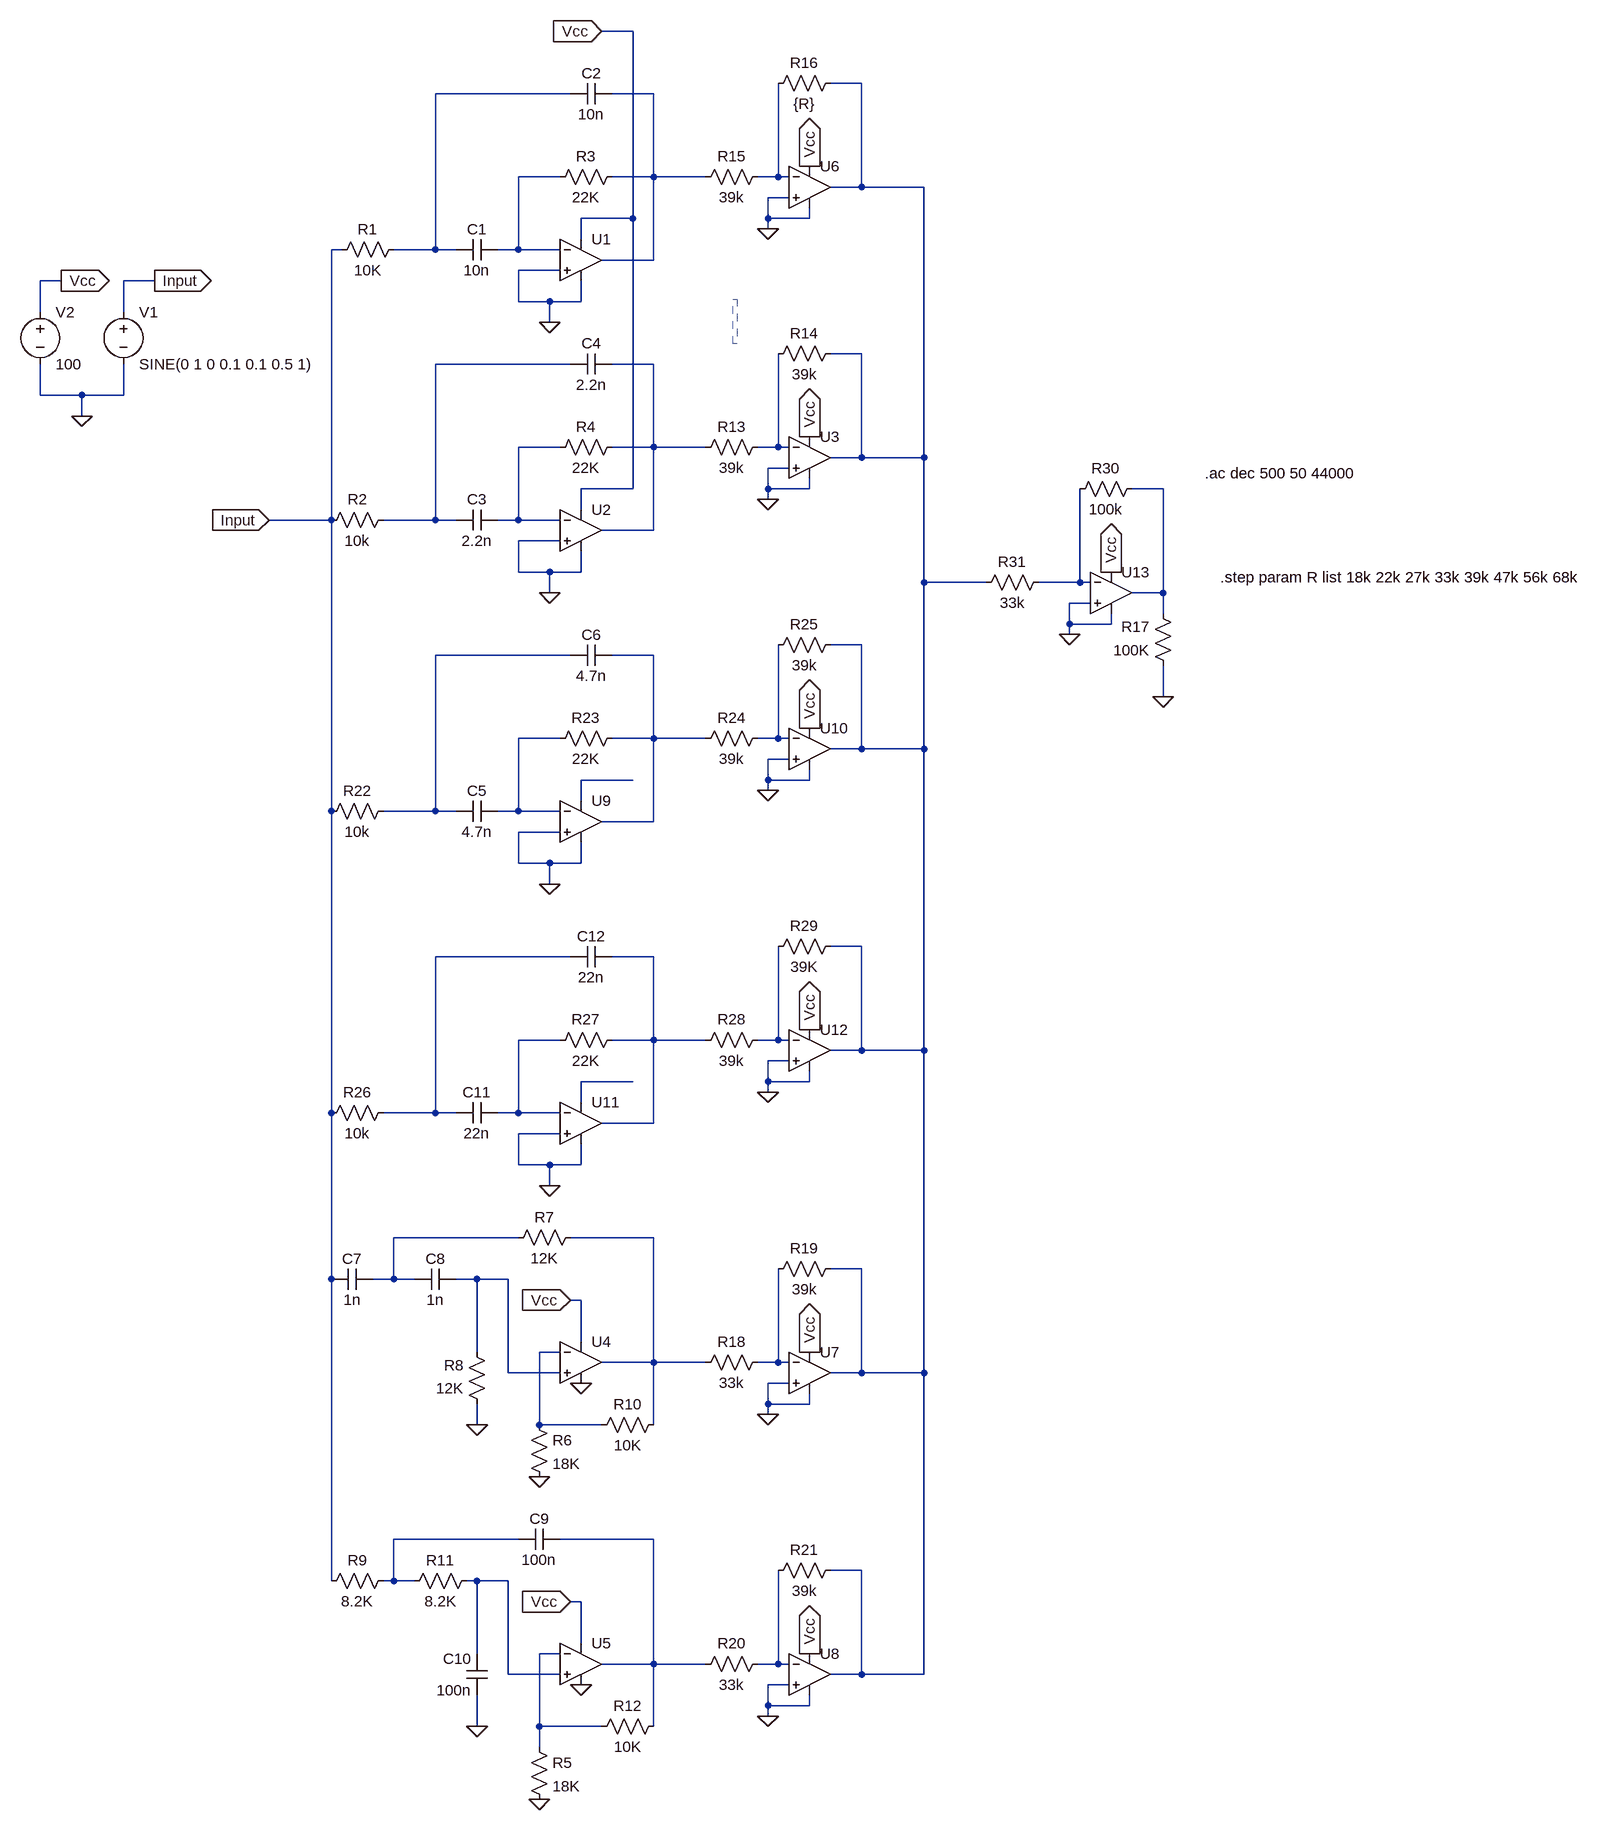
[diagram p0: schematic equalizer-analog.asc]
equalizer-analog.asc, the LTspice schematic file:
Version 4
SHEET 1 2408 2608
WIRE 928 -176 880 -176
WIRE 1280 -96 1232 -96
WIRE 832 -80 624 -80
WIRE 960 -80 896 -80
WIRE 816 48 752 48
WIRE 960 48 960 -80
WIRE 960 48 896 48
WIRE 1040 48 960 48
WIRE 1152 48 1152 -96
WIRE 1152 48 1120 48
WIRE 1168 48 1152 48
WIRE 1280 64 1280 -96
WIRE 1280 64 1232 64
WIRE 1376 64 1280 64
WIRE 1168 80 1136 80
WIRE 928 112 928 -176
WIRE 928 112 848 112
WIRE 1136 112 1136 80
WIRE 1200 112 1200 96
WIRE 1200 112 1136 112
WIRE 1136 128 1136 112
WIRE 848 144 848 112
WIRE 480 160 464 160
WIRE 624 160 624 -80
WIRE 624 160 560 160
WIRE 656 160 624 160
WIRE 752 160 752 48
WIRE 752 160 720 160
WIRE 816 160 752 160
WIRE 960 176 960 48
WIRE 960 176 880 176
WIRE 816 192 752 192
WIRE 48 208 16 208
WIRE 192 208 144 208
WIRE 752 240 752 192
WIRE 800 240 752 240
WIRE 848 240 848 208
WIRE 848 240 800 240
WIRE 16 256 16 208
WIRE 144 256 144 208
WIRE 800 272 800 240
WIRE 1280 320 1232 320
WIRE 832 336 624 336
WIRE 960 336 896 336
WIRE 16 384 16 336
WIRE 80 384 16 384
WIRE 144 384 144 336
WIRE 144 384 80 384
WIRE 80 416 80 384
WIRE 816 464 752 464
WIRE 960 464 960 336
WIRE 960 464 896 464
WIRE 1040 464 960 464
WIRE 1152 464 1152 320
WIRE 1152 464 1120 464
WIRE 1168 464 1152 464
WIRE 1280 480 1280 320
WIRE 1280 480 1232 480
WIRE 1376 480 1376 64
WIRE 1376 480 1280 480
WIRE 1168 496 1136 496
WIRE 928 528 928 112
WIRE 928 528 848 528
WIRE 1136 528 1136 496
WIRE 1200 528 1200 512
WIRE 1200 528 1136 528
WIRE 1744 528 1696 528
WIRE 1136 544 1136 528
WIRE 848 560 848 528
WIRE 464 576 464 160
WIRE 464 576 368 576
WIRE 624 576 624 336
WIRE 624 576 544 576
WIRE 656 576 624 576
WIRE 752 576 752 464
WIRE 752 576 720 576
WIRE 816 576 752 576
WIRE 960 592 960 464
WIRE 960 592 880 592
WIRE 816 608 752 608
WIRE 752 656 752 608
WIRE 800 656 752 656
WIRE 848 656 848 624
WIRE 848 656 800 656
WIRE 1376 672 1376 480
WIRE 1472 672 1376 672
WIRE 1616 672 1616 528
WIRE 1616 672 1552 672
WIRE 1632 672 1616 672
WIRE 800 688 800 656
WIRE 1744 688 1744 528
WIRE 1744 688 1696 688
WIRE 1632 704 1600 704
WIRE 1744 720 1744 688
WIRE 1600 736 1600 704
WIRE 1664 736 1664 720
WIRE 1664 736 1600 736
WIRE 1600 752 1600 736
WIRE 1280 768 1232 768
WIRE 832 784 624 784
WIRE 960 784 896 784
WIRE 1744 848 1744 800
WIRE 816 912 752 912
WIRE 960 912 960 784
WIRE 960 912 896 912
WIRE 1040 912 960 912
WIRE 1152 912 1152 768
WIRE 1152 912 1120 912
WIRE 1168 912 1152 912
WIRE 1280 928 1280 768
WIRE 1280 928 1232 928
WIRE 1376 928 1376 672
WIRE 1376 928 1280 928
WIRE 1168 944 1136 944
WIRE 928 976 848 976
WIRE 1136 976 1136 944
WIRE 1200 976 1200 960
WIRE 1200 976 1136 976
WIRE 1136 992 1136 976
WIRE 848 1008 848 976
WIRE 464 1024 464 576
WIRE 624 1024 624 784
WIRE 624 1024 544 1024
WIRE 656 1024 624 1024
WIRE 752 1024 752 912
WIRE 752 1024 720 1024
WIRE 816 1024 752 1024
WIRE 960 1040 960 912
WIRE 960 1040 880 1040
WIRE 816 1056 752 1056
WIRE 752 1104 752 1056
WIRE 800 1104 752 1104
WIRE 848 1104 848 1072
WIRE 848 1104 800 1104
WIRE 800 1136 800 1104
WIRE 1280 1232 1232 1232
WIRE 832 1248 624 1248
WIRE 960 1248 896 1248
WIRE 816 1376 752 1376
WIRE 960 1376 960 1248
WIRE 960 1376 896 1376
WIRE 1040 1376 960 1376
WIRE 1152 1376 1152 1232
WIRE 1152 1376 1120 1376
WIRE 1168 1376 1152 1376
WIRE 1280 1392 1280 1232
WIRE 1280 1392 1232 1392
WIRE 1376 1392 1376 928
WIRE 1376 1392 1280 1392
WIRE 1168 1408 1136 1408
WIRE 928 1440 848 1440
WIRE 1136 1440 1136 1408
WIRE 1200 1440 1200 1424
WIRE 1200 1440 1136 1440
WIRE 1136 1456 1136 1440
WIRE 848 1472 848 1440
WIRE 464 1488 464 1024
WIRE 624 1488 624 1248
WIRE 624 1488 544 1488
WIRE 656 1488 624 1488
WIRE 752 1488 752 1376
WIRE 752 1488 720 1488
WIRE 816 1488 752 1488
WIRE 960 1504 960 1376
WIRE 960 1504 880 1504
WIRE 816 1520 752 1520
WIRE 752 1568 752 1520
WIRE 800 1568 752 1568
WIRE 848 1568 848 1536
WIRE 848 1568 800 1568
WIRE 800 1600 800 1568
WIRE 752 1680 560 1680
WIRE 960 1680 832 1680
WIRE 1280 1728 1232 1728
WIRE 464 1744 464 1488
WIRE 560 1744 560 1680
WIRE 560 1744 528 1744
WIRE 592 1744 560 1744
WIRE 688 1744 656 1744
WIRE 736 1744 688 1744
WIRE 848 1776 832 1776
WIRE 848 1840 848 1776
WIRE 688 1856 688 1744
WIRE 816 1856 784 1856
WIRE 960 1872 960 1680
WIRE 960 1872 880 1872
WIRE 1040 1872 960 1872
WIRE 1152 1872 1152 1728
WIRE 1152 1872 1120 1872
WIRE 1168 1872 1152 1872
WIRE 736 1888 736 1744
WIRE 816 1888 736 1888
WIRE 1280 1888 1280 1728
WIRE 1280 1888 1232 1888
WIRE 1376 1888 1376 1392
WIRE 1376 1888 1280 1888
WIRE 1168 1904 1136 1904
WIRE 1136 1936 1136 1904
WIRE 1200 1936 1200 1920
WIRE 1200 1936 1136 1936
WIRE 1136 1952 1136 1936
WIRE 688 1968 688 1936
WIRE 784 1968 784 1856
WIRE 880 1968 784 1968
WIRE 960 1968 960 1872
WIRE 752 2144 560 2144
WIRE 960 2144 816 2144
WIRE 1280 2192 1232 2192
WIRE 464 2208 464 1744
WIRE 560 2208 560 2144
WIRE 560 2208 544 2208
WIRE 592 2208 560 2208
WIRE 688 2208 672 2208
WIRE 736 2208 688 2208
WIRE 848 2240 832 2240
WIRE 848 2304 848 2240
WIRE 688 2320 688 2208
WIRE 816 2320 784 2320
WIRE 960 2336 960 2144
WIRE 960 2336 880 2336
WIRE 1040 2336 960 2336
WIRE 1152 2336 1152 2192
WIRE 1152 2336 1120 2336
WIRE 1168 2336 1152 2336
WIRE 736 2352 736 2208
WIRE 816 2352 736 2352
WIRE 1280 2352 1280 2192
WIRE 1280 2352 1232 2352
WIRE 1376 2352 1376 1888
WIRE 1376 2352 1280 2352
WIRE 1168 2368 1136 2368
WIRE 1136 2400 1136 2368
WIRE 1200 2400 1200 2384
WIRE 1200 2400 1136 2400
WIRE 1136 2416 1136 2400
WIRE 688 2432 688 2384
WIRE 784 2432 784 2320
WIRE 880 2432 784 2432
WIRE 960 2432 960 2336
WIRE 784 2464 784 2432
FLAG 800 272 0
FLAG 800 688 0
FLAG 48 208 Vcc
IOPIN 48 208 Out
FLAG 880 -176 Vcc
IOPIN 880 -176 In
FLAG 80 416 0
FLAG 192 208 Input
IOPIN 192 208 Out
FLAG 368 576 Input
IOPIN 368 576 In
FLAG 832 1776 Vcc
IOPIN 832 1776 In
FLAG 848 1904 0
FLAG 688 1968 0
FLAG 832 2240 Vcc
IOPIN 832 2240 In
FLAG 848 2368 0
FLAG 688 2432 0
FLAG 784 2544 0
FLAG 784 2048 0
FLAG 1136 544 0
FLAG 1200 448 Vcc
IOPIN 1200 448 Out
FLAG 1136 128 0
FLAG 1200 32 Vcc
IOPIN 1200 32 Out
FLAG 1744 848 0
FLAG 1136 1952 0
FLAG 1200 1856 Vcc
IOPIN 1200 1856 Out
FLAG 1136 2416 0
FLAG 1200 2320 Vcc
IOPIN 1200 2320 Out
FLAG 800 1136 0
FLAG 1136 992 0
FLAG 1200 896 Vcc
IOPIN 1200 896 Out
FLAG 800 1600 0
FLAG 1136 1456 0
FLAG 1200 1360 Vcc
IOPIN 1200 1360 Out
FLAG 1600 752 0
FLAG 1664 656 Vcc
IOPIN 1664 656 Out
SYMBOL voltage 144 240 R0
SYMATTR InstName V1
SYMATTR Value SINE(0 1 0 0.1 0.1 0.5 1)
SYMATTR Value2 AC 1
SYMBOL res 576 144 R90
WINDOW 0 0 56 VBottom 2
WINDOW 3 32 56 VTop 2
SYMATTR InstName R1
SYMATTR Value 10K
SYMBOL res 912 32 R90
WINDOW 0 0 56 VBottom 2
WINDOW 3 32 56 VTop 2
SYMATTR InstName R3
SYMATTR Value 22K
SYMBOL cap 720 144 R90
WINDOW 0 0 32 VBottom 2
WINDOW 3 32 32 VTop 2
SYMATTR InstName C1
SYMATTR Value 10n
SYMBOL cap 896 -96 R90
WINDOW 0 0 32 VBottom 2
WINDOW 3 32 32 VTop 2
SYMATTR InstName C2
SYMATTR Value 10n
SYMBOL OpAmps/UniversalOpAmp 848 176 R0
SYMATTR InstName U1
SYMBOL res 560 560 R90
WINDOW 0 0 56 VBottom 2
WINDOW 3 32 56 VTop 2
SYMATTR InstName R2
SYMATTR Value 10k
SYMBOL res 912 448 R90
WINDOW 0 0 56 VBottom 2
WINDOW 3 32 56 VTop 2
SYMATTR InstName R4
SYMATTR Value 22K
SYMBOL cap 720 560 R90
WINDOW 0 0 32 VBottom 2
WINDOW 3 32 32 VTop 2
SYMATTR InstName C3
SYMATTR Value 2.2n
SYMBOL cap 896 320 R90
WINDOW 0 0 32 VBottom 2
WINDOW 3 32 32 VTop 2
SYMATTR InstName C4
SYMATTR Value 2.2n
SYMBOL OpAmps/UniversalOpAmp 848 592 R0
SYMATTR InstName U2
SYMBOL voltage 16 240 R0
SYMATTR InstName V2
SYMATTR Value 100
SYMBOL cap 528 1728 R90
WINDOW 0 0 32 VBottom 2
WINDOW 3 32 32 VTop 2
SYMATTR InstName C7
SYMATTR Value 1n
SYMBOL cap 656 1728 R90
WINDOW 0 0 32 VBottom 2
WINDOW 3 32 32 VTop 2
SYMATTR InstName C8
SYMATTR Value 1n
SYMBOL res 848 1664 R90
WINDOW 0 0 56 VBottom 2
WINDOW 3 32 56 VTop 2
SYMATTR InstName R7
SYMATTR Value 12K
SYMBOL res 704 1952 R180
WINDOW 0 36 76 Left 2
WINDOW 3 36 40 Left 2
SYMATTR InstName R8
SYMATTR Value 12K
SYMBOL res 864 1984 R270
WINDOW 0 32 56 VTop 2
WINDOW 3 0 56 VBottom 2
SYMATTR InstName R10
SYMATTR Value 10K
SYMBOL OpAmps/UniversalOpAmp 848 1872 R0
SYMATTR InstName U4
SYMBOL res 864 2448 R270
WINDOW 0 32 56 VTop 2
WINDOW 3 0 56 VBottom 2
SYMATTR InstName R12
SYMATTR Value 10K
SYMBOL OpAmps/UniversalOpAmp 848 2336 R0
SYMATTR InstName U5
SYMBOL cap 816 2128 R90
WINDOW 0 0 32 VBottom 2
WINDOW 3 32 32 VTop 2
SYMATTR InstName C9
SYMATTR Value 100n
SYMBOL cap 704 2384 R180
WINDOW 0 24 56 Left 2
WINDOW 3 24 8 Left 2
SYMATTR InstName C10
SYMATTR Value 100n
SYMBOL res 448 2224 R270
WINDOW 0 32 56 VTop 2
WINDOW 3 0 56 VBottom 2
SYMATTR InstName R9
SYMATTR Value 8.2K
SYMBOL res 576 2224 R270
WINDOW 0 32 56 VTop 2
WINDOW 3 0 56 VBottom 2
SYMATTR InstName R11
SYMATTR Value 8.2K
SYMBOL res 768 2448 R0
SYMATTR InstName R5
SYMATTR Value 18K
SYMBOL res 768 1952 R0
SYMATTR InstName R6
SYMATTR Value 18K
SYMBOL OpAmps/UniversalOpAmp 1200 480 R0
SYMATTR InstName U3
SYMBOL res 1136 448 R90
WINDOW 0 0 56 VBottom 2
WINDOW 3 32 56 VTop 2
SYMATTR InstName R13
SYMATTR Value 39k
SYMBOL res 1248 304 R90
WINDOW 0 0 56 VBottom 2
WINDOW 3 32 56 VTop 2
SYMATTR InstName R14
SYMATTR Value 39k
SYMBOL OpAmps/UniversalOpAmp 1200 64 R0
SYMATTR InstName U6
SYMBOL res 1136 32 R90
WINDOW 0 0 56 VBottom 2
WINDOW 3 32 56 VTop 2
SYMATTR InstName R15
SYMATTR Value 39k
SYMBOL res 1248 -112 R90
WINDOW 0 0 56 VBottom 2
WINDOW 3 32 56 VTop 2
SYMATTR InstName R16
SYMATTR Value {R}
SYMBOL res 1760 816 R180
WINDOW 0 36 76 Left 2
WINDOW 3 36 40 Left 2
SYMATTR InstName R17
SYMATTR Value 100K
SYMBOL OpAmps/UniversalOpAmp 1200 1888 R0
SYMATTR InstName U7
SYMBOL res 1136 1856 R90
WINDOW 0 0 56 VBottom 2
WINDOW 3 32 56 VTop 2
SYMATTR InstName R18
SYMATTR Value 33k
SYMBOL res 1248 1712 R90
WINDOW 0 0 56 VBottom 2
WINDOW 3 32 56 VTop 2
SYMATTR InstName R19
SYMATTR Value 39k
SYMBOL OpAmps/UniversalOpAmp 1200 2352 R0
SYMATTR InstName U8
SYMBOL res 1136 2320 R90
WINDOW 0 0 56 VBottom 2
WINDOW 3 32 56 VTop 2
SYMATTR InstName R20
SYMATTR Value 33k
SYMBOL res 1248 2176 R90
WINDOW 0 0 56 VBottom 2
WINDOW 3 32 56 VTop 2
SYMATTR InstName R21
SYMATTR Value 39k
SYMBOL res 560 1008 R90
WINDOW 0 0 56 VBottom 2
WINDOW 3 32 56 VTop 2
SYMATTR InstName R22
SYMATTR Value 10k
SYMBOL res 912 896 R90
WINDOW 0 0 56 VBottom 2
WINDOW 3 32 56 VTop 2
SYMATTR InstName R23
SYMATTR Value 22K
SYMBOL cap 720 1008 R90
WINDOW 0 0 32 VBottom 2
WINDOW 3 32 32 VTop 2
SYMATTR InstName C5
SYMATTR Value 4.7n
SYMBOL cap 896 768 R90
WINDOW 0 0 32 VBottom 2
WINDOW 3 32 32 VTop 2
SYMATTR InstName C6
SYMATTR Value 4.7n
SYMBOL OpAmps/UniversalOpAmp 848 1040 R0
SYMATTR InstName U9
SYMBOL OpAmps/UniversalOpAmp 1200 928 R0
SYMATTR InstName U10
SYMBOL res 1136 896 R90
WINDOW 0 0 56 VBottom 2
WINDOW 3 32 56 VTop 2
SYMATTR InstName R24
SYMATTR Value 39k
SYMBOL res 1248 752 R90
WINDOW 0 0 56 VBottom 2
WINDOW 3 32 56 VTop 2
SYMATTR InstName R25
SYMATTR Value 39k
SYMBOL res 560 1472 R90
WINDOW 0 0 56 VBottom 2
WINDOW 3 32 56 VTop 2
SYMATTR InstName R26
SYMATTR Value 10k
SYMBOL res 912 1360 R90
WINDOW 0 0 56 VBottom 2
WINDOW 3 32 56 VTop 2
SYMATTR InstName R27
SYMATTR Value 22K
SYMBOL cap 720 1472 R90
WINDOW 0 0 32 VBottom 2
WINDOW 3 32 32 VTop 2
SYMATTR InstName C11
SYMATTR Value 22n
SYMBOL cap 896 1232 R90
WINDOW 0 0 32 VBottom 2
WINDOW 3 32 32 VTop 2
SYMATTR InstName C12
SYMATTR Value 22n
SYMBOL OpAmps/UniversalOpAmp 848 1504 R0
SYMATTR InstName U11
SYMBOL OpAmps/UniversalOpAmp 1200 1392 R0
SYMATTR InstName U12
SYMBOL res 1136 1360 R90
WINDOW 0 0 56 VBottom 2
WINDOW 3 32 56 VTop 2
SYMATTR InstName R28
SYMATTR Value 39k
SYMBOL res 1248 1216 R90
WINDOW 0 0 56 VBottom 2
WINDOW 3 32 56 VTop 2
SYMATTR InstName R29
SYMATTR Value 39K
SYMBOL OpAmps/UniversalOpAmp 1664 688 R0
SYMATTR InstName U13
SYMBOL res 1712 512 R90
WINDOW 0 0 56 VBottom 2
WINDOW 3 32 56 VTop 2
SYMATTR InstName R30
SYMATTR Value 100k
SYMBOL res 1568 656 R90
WINDOW 0 0 56 VBottom 2
WINDOW 3 32 56 VTop 2
SYMATTR InstName R31
SYMATTR Value 33k
TEXT 1808 504 Left 2 !.ac dec 500 50 44000
TEXT 1832 664 Left 2 !.step param R list 18k 22k 27k 33k 39k 47k 56k 68k
RECTANGLE Normal 1082 236 1088 305 2

The netlist it stands for:
* equalizer-analog.asc
V1 Input 0 SINE(0 1 0 0.1 0.1 0.5 1) AC 1
R1 N002 Input 10K
R3 N003 N004 22K
C1 N004 N002 10n
C2 N003 N002 10n
XU1 0 N004 Vcc 0 N003 level1 Avol=1Meg GBW=10Meg Vos=0 En=0 Enk=0 In=0 Ink=0 Rin=500Meg  ; pins In+ In- V+ V- OUT
R2 N006 Input 10k
R4 N007 N008 22K
C3 N008 N006 2.2n
C4 N007 N006 2.2n
XU2 0 N008 Vcc 0 N007 level1 Avol=1Meg GBW=10Meg Vos=0 En=0 Enk=0 In=0 Ink=0 Rin=500Meg  ; pins In+ In- V+ V- OUT
V2 Vcc 0 100
C7 N022 Input 1n
C8 N024 N022 1n
R7 N023 N022 12K
R8 0 N024 12K
R10 N025 N023 10K
XU4 N024 N025 Vcc 0 N023 level1 Avol=1Meg GBW=10Meg Vos=0 En=0 Enk=0 In=0 Ink=0 Rin=500Meg  ; pins In+ In- V+ V- OUT
R12 N030 N028 10K
XU5 N029 N030 Vcc 0 N028 level1 Avol=1Meg GBW=10Meg Vos=0 En=0 Enk=0 In=0 Ink=0 Rin=500Meg  ; pins In+ In- V+ V- OUT
C9 N028 N027 100n
C10 0 N029 100n
R9 Input N027 8.2K
R11 N027 N029 8.2K
R5 N030 0 18K
R6 N025 0 18K
XU3 0 N009 Vcc 0 N001 level1 Avol=1Meg GBW=10Meg Vos=0 En=0 Enk=0 In=0 Ink=0 Rin=500Meg  ; pins In+ In- V+ V- OUT
R13 N009 N007 39k
R14 N001 N009 39k
XU6 0 N005 Vcc 0 N001 level1 Avol=1Meg GBW=10Meg Vos=0 En=0 Enk=0 In=0 Ink=0 Rin=500Meg  ; pins In+ In- V+ V- OUT
R15 N005 N003 39k
R16 N001 N005 {R}
R17 0 N010 100K
XU7 0 N026 Vcc 0 N001 level1 Avol=1Meg GBW=10Meg Vos=0 En=0 Enk=0 In=0 Ink=0 Rin=500Meg  ; pins In+ In- V+ V- OUT
R18 N026 N023 33k
R19 N001 N026 39k
XU8 0 N031 Vcc 0 N001 level1 Avol=1Meg GBW=10Meg Vos=0 En=0 Enk=0 In=0 Ink=0 Rin=500Meg  ; pins In+ In- V+ V- OUT
R20 N031 N028 33k
R21 N001 N031 39k
R22 N012 Input 10k
R23 N013 N014 22K
C5 N014 N012 4.7n
C6 N013 N012 4.7n
XU9 0 N014 N016 0 N013 level1 Avol=1Meg GBW=10Meg Vos=0 En=0 Enk=0 In=0 Ink=0 Rin=500Meg  ; pins In+ In- V+ V- OUT
XU10 0 N015 Vcc 0 N001 level1 Avol=1Meg GBW=10Meg Vos=0 En=0 Enk=0 In=0 Ink=0 Rin=500Meg  ; pins In+ In- V+ V- OUT
R24 N015 N013 39k
R25 N001 N015 39k
R26 N017 Input 10k
R27 N018 N019 22K
C11 N019 N017 22n
C12 N018 N017 22n
XU11 0 N019 N021 0 N018 level1 Avol=1Meg GBW=10Meg Vos=0 En=0 Enk=0 In=0 Ink=0 Rin=500Meg  ; pins In+ In- V+ V- OUT
XU12 0 N020 Vcc 0 N001 level1 Avol=1Meg GBW=10Meg Vos=0 En=0 Enk=0 In=0 Ink=0 Rin=500Meg  ; pins In+ In- V+ V- OUT
R28 N020 N018 39k
R29 N001 N020 39K
XU13 0 N011 Vcc 0 N010 level1 Avol=1Meg GBW=10Meg Vos=0 En=0 Enk=0 In=0 Ink=0 Rin=500Meg  ; pins In+ In- V+ V- OUT
R30 N010 N011 100k
R31 N011 N001 33k
.ac dec 500 50 44000
.step param R list 18k 22k 27k 33k 39k 47k 56k 68k
.lib UniversalOpAmp1.lib
.backanno
.end